# Altium schematic sheet temperature_controller.SchDoc
size A4
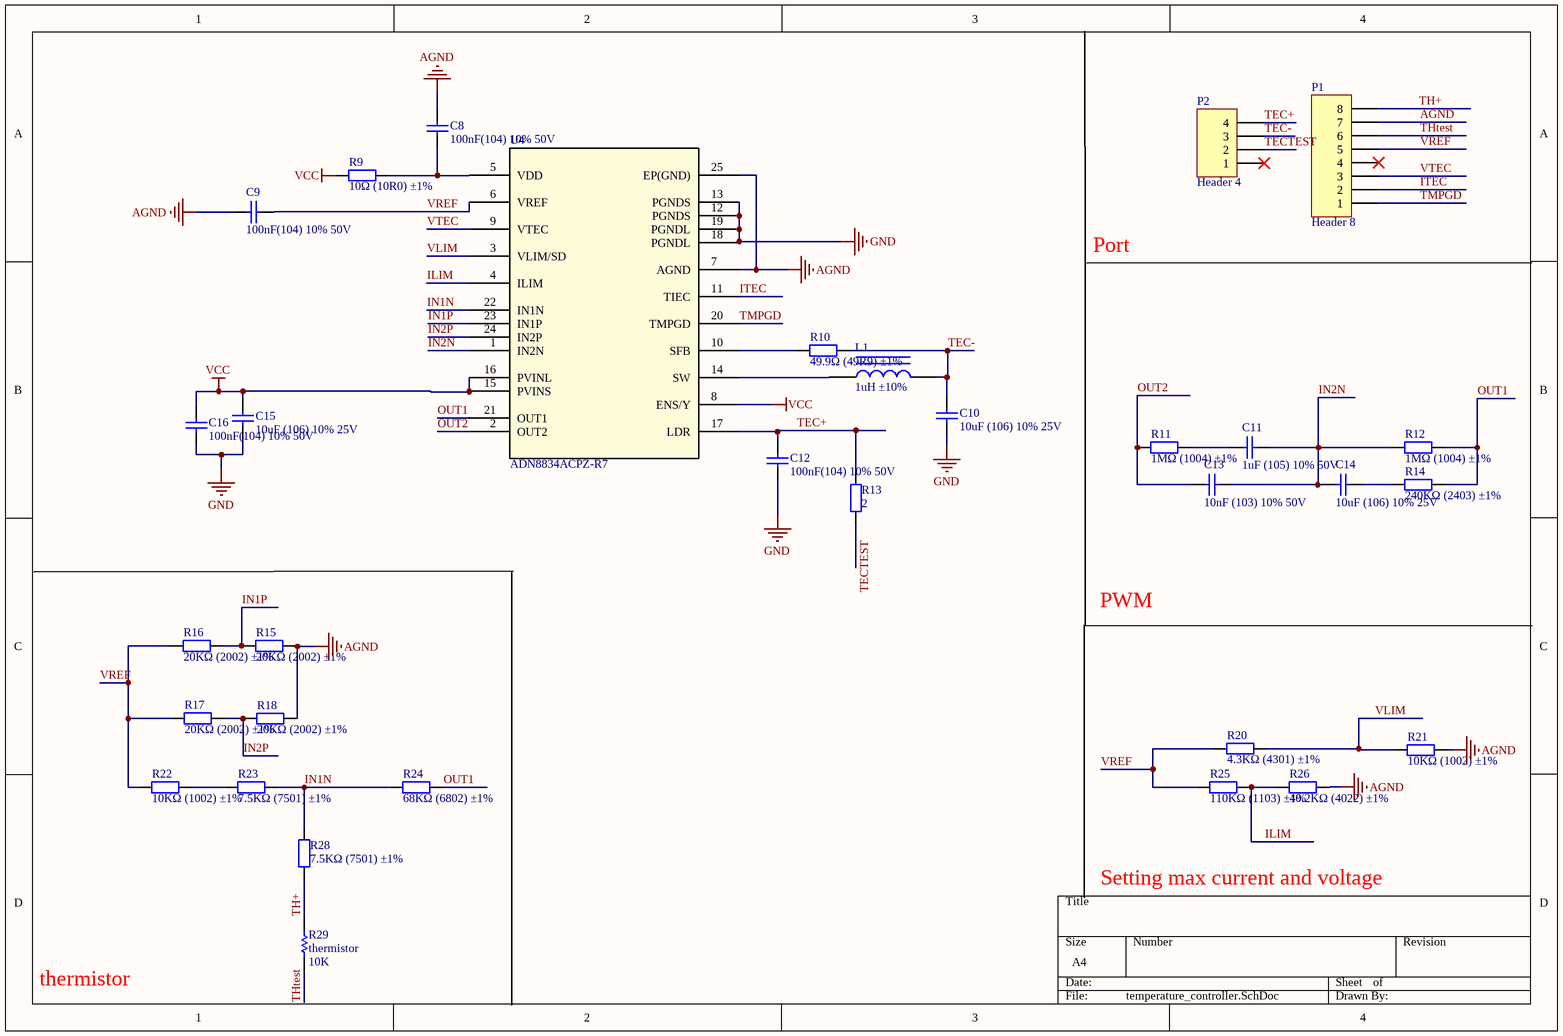
[diagram p0: temperature_controller.SchDoc]

## Parts
C8  100nF(104) 10% 50V  [0805_C]
C9  100nF(104) 10% 50V  [0805_C]
C10  10uF (106) 10% 25V  [0805_C]
C11  1uF (105) 10% 50V  [0805_C]
C12  100nF(104) 10% 50V  [0805_C]
C13  10nF (103) 10% 50V  [0805_C]
C14  10uF (106) 10% 25V  [0805_C]
C15  10uF (106) 10% 25V  [0805_C]
C16  100nF(104) 10% 50V  [0805_C]
L1  1uH ±10%  [0805_L]
P1  Header 8  [HDR1X8]
P2  Header 4  [HDR1X4]
R9  10Ω (10R0) ±1%  [0603_R]
R10  49.9Ω (49R9) ±1%  [0603_R]
R11  1MΩ (1004) ±1%  [0603_R]
R12  1MΩ (1004) ±1%  [0603_R]
R13  2  [AXIAL-0.4]
R14  240KΩ (2403) ±1%  [0603_R]
R15  20KΩ (2002) ±1%  [0603_R]
R16  20KΩ (2002) ±1%  [0603_R]
R17  20KΩ (2002) ±1%  [0603_R]
R18  20KΩ (2002) ±1%  [0603_R]
R20  4.3KΩ (4301) ±1%  [0603_R]
R21  10KΩ (1002) ±1%  [0603_R]
R22  10KΩ (1002) ±1%  [0603_R]
R23  7.5KΩ (7501) ±1%  [0603_R]
R24  68KΩ (6802) ±1%  [0603_R]
R25  110KΩ (1103) ±1%  [0603_R]
R26  40.2KΩ (4022) ±1%  [0603_R]
R28  7.5KΩ (7501) ±1%  [0603_R]
R29  thermistor  value 10K  [AXIAL-0.3]
U4  ADN8834ACPZ-R7  [CP_24_7]

## Nets
AGND: C8.2 C9.2 P1.7 R15.1 R18.1 R21.2 R26.2 U4.7(AGND) U4.25(EP(GND))
GND: C10.2 C12.1 C15.2 C16.2 U4.12(PGNDS) U4.13(PGNDS) U4.18(PGNDL) U4.19(PGNDL)
VCC: C15.1 C16.1 R9.1 U4.8(ENS/Y) U4.15(PVINS) U4.16(PVINL)
ILIM: R26.1 U4.4(ILIM)
IN1N: R23.1 R24.2 R28.2 U4.22(IN1N)
IN1P: R15.2 R16.2 U4.23(IN1P)
IN2N: C11.1 C13.1 C14.2 R12.1 U4.1(IN2N)
IN2P: R17.1 R18.2 U4.24(IN2P)
ITEC: P1.2 U4.11(TIEC)
OUT1: R12.2 R14.2 R24.1 U4.21(OUT1)
OUT2: C13.2 R11.1 U4.2(OUT2)
TEC+: C12.2 P2.4 R13.2 U4.17(LDR)
TEC-: C10.1 L1.2 P2.3 R10.2
TECTEST: P2.2 R13.1
TH+: P1.8 R28.1 R29.2
THtest: P1.6 R29.1
TMPGD: P1.1 U4.20(TMPGD)
VLIM: R20.2 R21.1 U4.3(VLIM/SD)
VREF: C9.1 P1.5 R16.1 R17.2 R20.1 R22.2 R25.1 U4.6(VREF)
VTEC: P1.3 U4.9(VTEC)
NetC8_1: C8.1 R9.2 U4.5(VDD)
NetC11_2: C11.2 R11.2
NetC14_1: C14.1 R14.1
NetL1_1: L1.1 U4.14(SW)
NetR10_1: R10.1 U4.10(SFB)
NetR22_1: R22.1 R23.2

Not connected (* = marked no-connect by the designer): P1 4*; P2 1*; R25 2

## Notes on the sheet
- Port
- PWM
- Setting max current and voltage
- thermistor

## Library data of the parts
C8 C9 C12 C16 = 0805 100nF(104) 10% 50V: 贴片电容; ComponentLink1Description: 供应商链接; ComponentLink1URL: http://www.szlcsc.com/product/details_50686.html; Package: 0805; Supplier: LC; SuppliersPartNumber: C49678
C10 C14 C15 = 0805 10uF (106) 10% 25V: 贴片电容; ComponentLink1Description: 供应商链接; ComponentLink1URL: http://www.szlcsc.com/product/details_16532.html; Package: 0805; Supplier: LC; SuppliersPartNumber: C15850
C11 = 0805 1uF (105) 10% 50V: 贴片电容; ComponentLink1Description: 供应商链接; ComponentLink1URL: http://www.szlcsc.com/product/details_29074.html; Package: 0805; Supplier: LC; SuppliersPartNumber: C28323
C13 = 0805 10nF (103) 10% 50V: 贴片电容; ComponentLink1Description: 供应商链接; ComponentLink1URL: http://www.szlcsc.com/product/details_2062.html; Package: 0805; Supplier: LC; SuppliersPartNumber: C1710
L1 = 0805 1uH 10%: 贴片电感; ComponentLink1Description: 供应商链接; ComponentLink1URL: http://www.szlcsc.com/product/details_1394.html; Package: 0805; Supplier: LC; SuppliersPartNumber: C1042
P1 = Header 8: Header, 8-Pin; LatestRevisionDate: 17-Jul-2002; LatestRevisionNote: Re-released for DXP Platform.; Publisher: Altium Limited
P2 = Header 4: Header, 4-Pin; LatestRevisionDate: 17-Jul-2002; LatestRevisionNote: Re-released for DXP Platform.; Publisher: Altium Limited
R9 = 0603 10Ω (10R0) 1%: 贴片电阻; ComponentLink1Description: 供应商链接; ComponentLink1URL: http://www.szlcsc.com/product/details_23586.html; Package: 0603; Supplier: LC; SuppliersPartNumber: C22859
R10 = 0603 49.9Ω (49R9) 1%: 贴片电阻; ComponentLink1Description: 供应商链接; ComponentLink1URL: http://www.szlcsc.com/product/details_23912.html; Package: 0603; Supplier: LC; SuppliersPartNumber: C23185
R11 R12 = 0603 1MΩ (1004) 1%: 贴片电阻; ComponentLink1Description: 供应商链接; ComponentLink1URL: http://www.szlcsc.com/product/details_23662.html; Package: 0603; Supplier: LC; SuppliersPartNumber: C22935
R13 = Res2: Resistor; Published: 8-Jun-2000; LatestRevisionDate: 17-Jul-2002; LatestRevisionNote: Re-released for DXP Platform.; PackageReference: AXIAL-0.4; Publisher: Altium Limited; PackageDescription: Axial Device, Thru-Hole; 2 Leads; 0.4 in Pin Spacing; Value: 2
R14 = 0603 240KΩ (2403) 1%: 贴片电阻; ComponentLink1Description: 供应商链接; ComponentLink1URL: http://www.szlcsc.com/product/details_4604.html; Package: 0603; Supplier: LC; SuppliersPartNumber: C4197
R15-R18 = 0603 20KΩ (2002) 1%: 贴片电阻; ComponentLink1Description: 供应商链接; ComponentLink1URL: http://www.szlcsc.com/product/details_4591.html; Package: 0603; Supplier: LC; SuppliersPartNumber: C4184
R20 = 0603 4.3KΩ (4301) 1%: 贴片电阻; ComponentLink1Description: 供应商链接; ComponentLink1URL: http://www.szlcsc.com/product/details_23886.html; Package: 0603; Supplier: LC; SuppliersPartNumber: C23159
R21 R22 = 0603 10KΩ (1002) 1%: 贴片电阻; ComponentLink1Description: 供应商链接; ComponentLink1URL: http://www.szlcsc.com/product/details_26547.html; Package: 0603; Supplier: LC; SuppliersPartNumber: C25804
R23 R28 = 0603 7.5KΩ (7501) 1%: 贴片电阻; ComponentLink1Description: 供应商链接; ComponentLink1URL: http://www.szlcsc.com/product/details_23961.html; Package: 0603; Supplier: LC; SuppliersPartNumber: C23234
R24 = 0603 68KΩ (6802) 1%: 贴片电阻; ComponentLink1Description: 供应商链接; ComponentLink1URL: http://www.szlcsc.com/product/details_23958.html; Package: 0603; Supplier: LC; SuppliersPartNumber: C23231
R25 = 0603 110KΩ (1103) 1%: 贴片电阻; ComponentLink1Description: 供应商链接; ComponentLink1URL: http://www.szlcsc.com/product/details_26548.html; Package: 0603; Supplier: LC; SuppliersPartNumber: C25805
R26 = 0603 40.2KΩ (4022) 1%: 贴片电阻; ComponentLink1Description: 供应商链接; ComponentLink1URL: http://www.szlcsc.com/product/details_13081.html; Package: 0603; Supplier: LC; SuppliersPartNumber: C12447
R29 = Res1: thermistor 1%; Published: 8-Jun-2000; LatestRevisionDate: 17-Jul-2002; LatestRevisionNote: Re-released for DXP Platform.; PackageReference: AXIAL-0.3; Publisher: Altium Limited; PackageDescription: Axial Device, Thru-Hole; 2 Leads; 0.3 in Pin Spacing
U4 = ADN8834ACPZ-R7: No Description Available; Copyright: Copyright (C) 2018 Accelerated Designs. All rights reserved; RefDes: RefDes; Type: DEV; Value: Value